# Altium schematic sheet MCU.SchDoc: MCU w/ USB & SDRAM Interface
size A2; DocumentNumber: 6; SheetNumber: 6; SheetTotal: 12
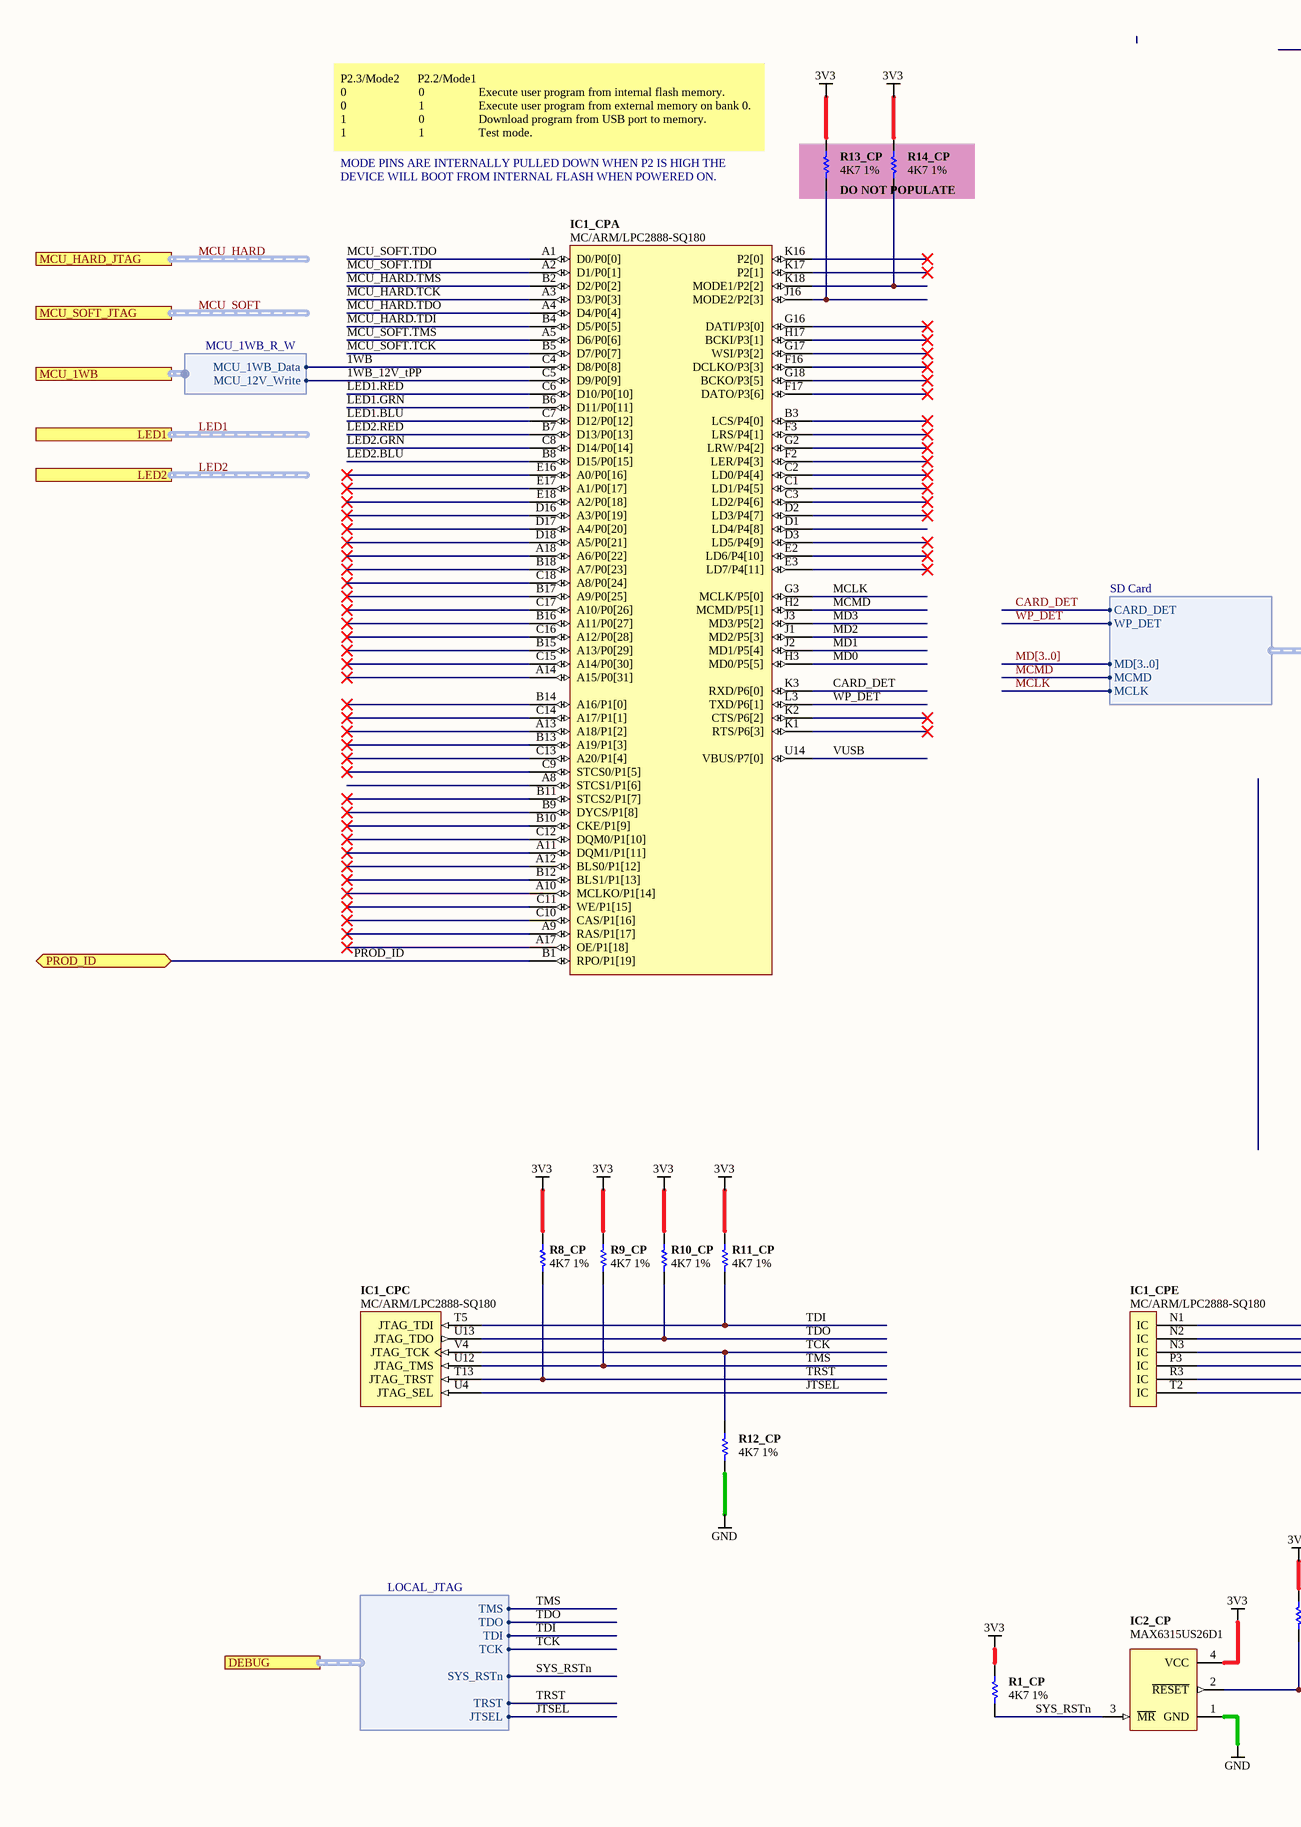
[diagram p0: MCU.SchDoc, left]
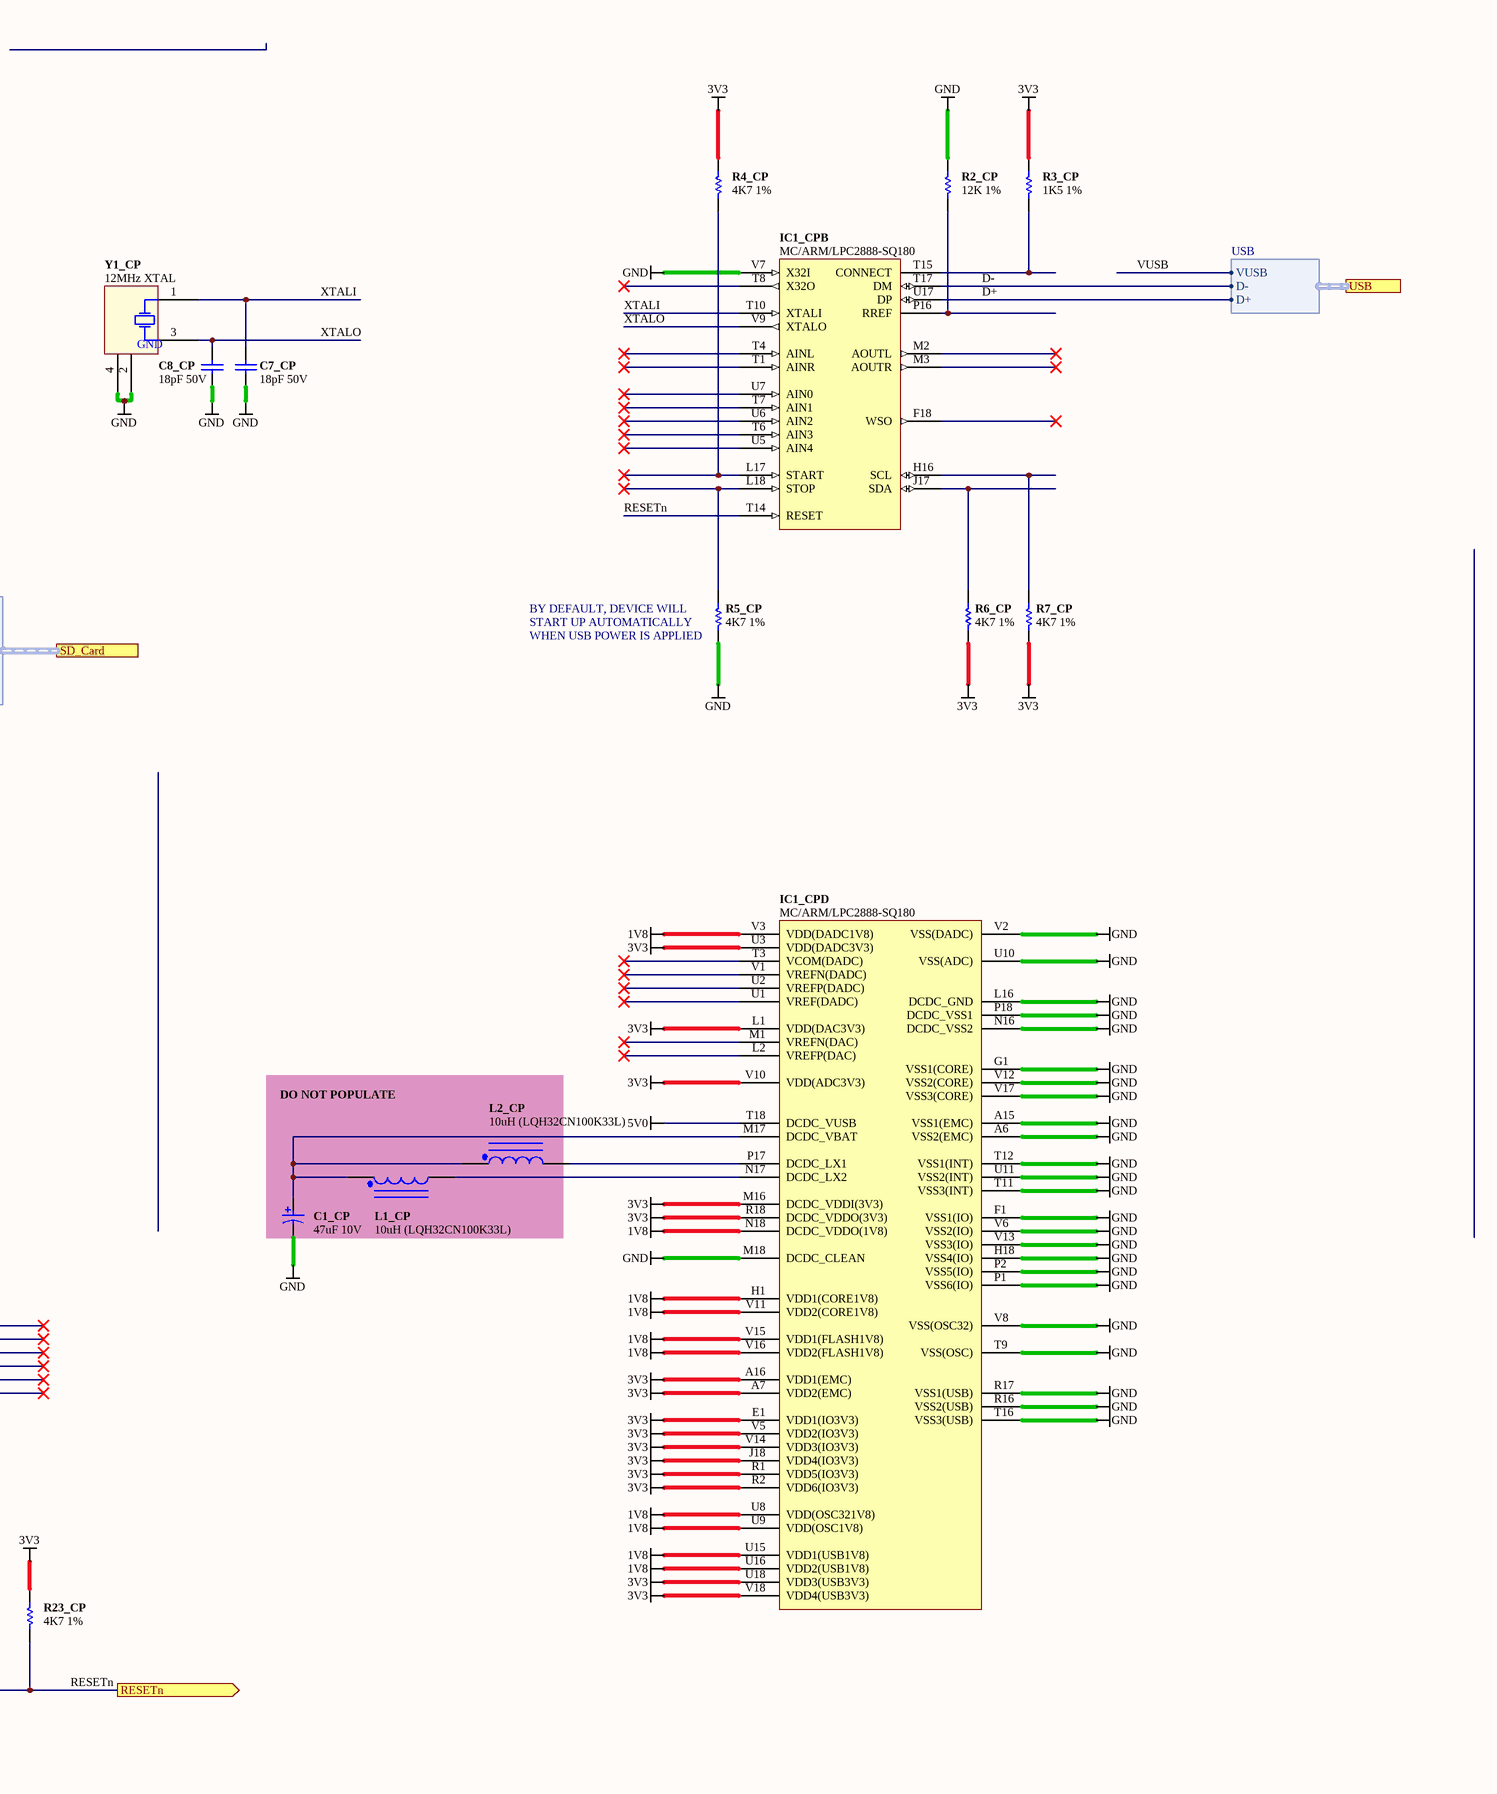
[diagram p1: MCU.SchDoc, right]

## Parts
C1_CP  47uF 10V  [CAPC3528-STAR]  (no BOM)
C7_CP  18pF 50V  [CAPC1005-STAR]
C8_CP  18pF 50V  [CAPC1005-STAR]
IC1_CP  MC/ARM/LPC2888-SQ180  [BGA50P18X18-180]  (parts A,B,C,D,E of 5)
IC2_CP  MAX6315US26D1  [SOT143]
L1_CP  10uH (LQH32CN100K33L)  [3261]  (no BOM)
L2_CP  10uH (LQH32CN100K33L)  [3261]  (no BOM)
R1_CP  4K7 1%  [RESC1005-STAR]
R2_CP  12K 1%  [RESC1005-STAR]
R3_CP  1K5 1%  [RESC1005-STAR]
R4_CP  4K7 1%  [RESC1005-STAR]
R5_CP  4K7 1%  [RESC1005-STAR]
R6_CP  4K7 1%  [RESC1005-STAR]
R7_CP  4K7 1%  [RESC1005-STAR]
R8_CP  4K7 1%  [RESC1005-STAR]
R9_CP  4K7 1%  [RESC1005-STAR]
R10_CP  4K7 1%  [RESC1005-STAR]
R11_CP  4K7 1%  [RESC1005-STAR]
R12_CP  4K7 1%  [RESC1005-STAR]
R13_CP  4K7 1%  [RESC1005-STAR]  (no BOM)
R14_CP  4K7 1%  [RESC1005-STAR]  (no BOM)
R23_CP  4K7 1%  [RESC1005-STAR]
Y1_CP  12MHz XTAL  [XTAL-200X126-4]

## Blocks framed on the sheet
DO NOT POPULATE: R13_CP R14_CP
DO NOT POPULATE: C1_CP L1_CP L2_CP

## Ports
DEBUG (harness LOCAL_JTAG), LED1 (harness RGB_LED), LED2 (harness RGB_LED), MCU_1WB (harness MCU_1WB_R_W), MCU_HARD_JTAG (harness JTAG), MCU_SOFT_JTAG (harness JTAG), PROD_ID (bidir), RESETn (out), SD_Card (harness SD Card), USB (harness USB)

## Harnesses
USB: VUSB, D-, D+
LOCAL_JTAG: TMS, TDO, TDI, TCK, SYS_RSTn, TRST, JTSEL
MCU_1WB_R_W: MCU_1WB_Data, MCU_12V_Write
SD Card: CARD_DET, WP_DET, MD[3..0], MCLK, MCMD

## Nets
1V8: IC1_CP.H1(VDD1(CORE1V8)) IC1_CP.N18(DCDC_VDDO(1V8)) IC1_CP.U8(VDD(OSC321V8)) IC1_CP.U9(VDD(OSC1V8)) IC1_CP.U15(VDD1(USB1V8)) IC1_CP.U16(VDD2(USB1V8)) IC1_CP.V3(VDD(DADC1V8)) IC1_CP.V11(VDD2(CORE1V8)) IC1_CP.V15(VDD1(FLASH1V8)) IC1_CP.V16(VDD2(FLASH1V8))
3V3: IC1_CP.A7(VDD2(EMC)) IC1_CP.A16(VDD1(EMC)) IC1_CP.E1(VDD1(IO3V3)) IC1_CP.J18(VDD4(IO3V3)) IC1_CP.L1(VDD(DAC3V3)) IC1_CP.M16(DCDC_VDDI(3V3)) IC1_CP.R1(VDD5(IO3V3)) IC1_CP.R2(VDD6(IO3V3)) IC1_CP.R18(DCDC_VDDO(3V3)) IC1_CP.U3(VDD(DADC3V3)) IC1_CP.U18(VDD3(USB3V3)) IC1_CP.V5(VDD2(IO3V3)) IC1_CP.V10(VDD(ADC3V3)) IC1_CP.V14(VDD3(IO3V3)) IC1_CP.V18(VDD4(USB3V3)) IC2_CP.4(VCC) R1_CP.2 R3_CP.2 R4_CP.2 R6_CP.2 R7_CP.2 R8_CP.2 R9_CP.2 R10_CP.2 R11_CP.2 R13_CP.2 R14_CP.2 R23_CP.2
5V0: IC1_CP.T18(DCDC_VUSB)
GND: C1_CP.2 C7_CP.2 C8_CP.2 IC1_CP.A6(VSS2(EMC)) IC1_CP.A15(VSS1(EMC)) IC1_CP.F1(VSS1(IO)) IC1_CP.G1(VSS1(CORE)) IC1_CP.H18(VSS4(IO)) IC1_CP.L16(DCDC_GND) IC1_CP.M18(DCDC_CLEAN) IC1_CP.N16(DCDC_VSS2) IC1_CP.P1(VSS6(IO)) IC1_CP.P2(VSS5(IO)) IC1_CP.P18(DCDC_VSS1) IC1_CP.R16(VSS2(USB)) IC1_CP.R17(VSS1(USB)) IC1_CP.T9(VSS(OSC)) IC1_CP.T11(VSS3(INT)) IC1_CP.T12(VSS1(INT)) IC1_CP.T16(VSS3(USB)) IC1_CP.U10(VSS(ADC)) IC1_CP.U11(VSS2(INT)) IC1_CP.V2(VSS(DADC)) IC1_CP.V6(VSS2(IO)) IC1_CP.V7(X32I) IC1_CP.V8(VSS(OSC32)) IC1_CP.V12(VSS2(CORE)) IC1_CP.V13(VSS3(IO)) IC1_CP.V17(VSS3(CORE)) IC2_CP.1(GND) R2_CP.2 R5_CP.2 R12_CP.2 Y1_CP.2(GND) Y1_CP.4(GND)
1WB: IC1_CP.C4(D8/P0[8]) ; port MCU_1WB.MCU_1WB_Data
1WB_12V_tPP: IC1_CP.C5(D9/P0[9]) ; port MCU_1WB.MCU_12V_Write
CARD_DET: IC1_CP.K3(RXD/P6[0]) ; port SD_Card.CARD_DET
D+: IC1_CP.U17(DP) ; port USB.D+
D-: IC1_CP.T17(DM) ; port USB.D-
JTSEL: IC1_CP.U4(JTAG_SEL) ; port DEBUG.JTSEL
LED1.BLU: IC1_CP.C7(D12/P0[12])
LED1.GRN: IC1_CP.B6(D11/P0[11])
LED1.RED: IC1_CP.C6(D10/P0[10])
LED2.BLU: IC1_CP.B8(D15/P0[15])
LED2.GRN: IC1_CP.C8(D14/P0[14])
LED2.RED: IC1_CP.B7(D13/P0[13])
MCLK: IC1_CP.G3(MCLK/P5[0]) ; port SD_Card.MCLK
MCMD: IC1_CP.H2(MCMD/P5[1]) ; port SD_Card.MCMD
MCU_HARD.TCK: IC1_CP.A3(D3/P0[3])
MCU_HARD.TDI: IC1_CP.B4(D5/P0[5])
MCU_HARD.TDO: IC1_CP.A4(D4/P0[4])
MCU_HARD.TMS: IC1_CP.B2(D2/P0[2])
MCU_SOFT.TCK: IC1_CP.B5(D7/P0[7])
MCU_SOFT.TDI: IC1_CP.A2(D1/P0[1])
MCU_SOFT.TDO: IC1_CP.A1(D0/P0[0])
MCU_SOFT.TMS: IC1_CP.A5(D6/P0[6])
MD0: IC1_CP.H3(MD0/P5[5])
MD1: IC1_CP.J2(MD1/P5[4])
MD2: IC1_CP.J1(MD2/P5[3])
MD3: IC1_CP.J3(MD3/P5[2])
PROD_ID: IC1_CP.B1(RPO/P1[19]) ; port PROD_ID
RESETn: IC1_CP.T14(RESET) IC2_CP.2(~{RESET}) R23_CP.1 ; port RESETn
SYS_RSTn: IC2_CP.3(~{MR}) R1_CP.1 ; port DEBUG.SYS_RSTn
TCK: IC1_CP.V4(JTAG_TCK) R12_CP.1 ; port DEBUG.TCK
TDI: IC1_CP.T5(JTAG_TDI) R11_CP.1 ; port DEBUG.TDI
TDO: IC1_CP.U13(JTAG_TDO) R10_CP.1 ; port DEBUG.TDO
TMS: IC1_CP.U12(JTAG_TMS) R9_CP.1 ; port DEBUG.TMS
TRST: IC1_CP.T13(JTAG_TRST) R8_CP.1 ; port DEBUG.TRST
VUSB: IC1_CP.U14(VBUS/P7[0]) ; port USB.VUSB
WP_DET: IC1_CP.L3(TXD/P6[1]) ; port SD_Card.WP_DET
XTALI: C7_CP.1 IC1_CP.T10(XTALI) Y1_CP.1(X1)
XTALO: C8_CP.1 IC1_CP.V9(XTALO) Y1_CP.3(X2)
NetC1_CP_1: C1_CP.1 IC1_CP.M17(DCDC_VBAT) L1_CP.1 L2_CP.1
NetIC1_CP_H16: IC1_CP.H16(SCL) R7_CP.1
NetIC1_CP_J16: IC1_CP.J16(MODE2/P2[3]) R13_CP.1
NetIC1_CP_J17: IC1_CP.J17(SDA) R6_CP.1
NetIC1_CP_K18: IC1_CP.K18(MODE1/P2[2]) R14_CP.1
NetIC1_CP_L17: IC1_CP.L17(START) R4_CP.1
NetIC1_CP_L18: IC1_CP.L18(STOP) R5_CP.1
NetIC1_CP_N17: IC1_CP.N17(DCDC_LX2) L1_CP.2
NetIC1_CP_P16: IC1_CP.P16(RREF) R2_CP.1
NetIC1_CP_P17: IC1_CP.P17(DCDC_LX1) L2_CP.2
NetIC1_CP_T15: IC1_CP.T15(CONNECT) R3_CP.1

Not connected (* = marked no-connect by the designer): IC1_CP A8(STCS1/P1[6]) A9(RAS/P1[17])* A10(MCLKO/P1[14])* A11(DQM1/P1[11])* A12(BLS0/P1[12])* A13(A18/P1[2])* A14(A15/P0[31])* A17(OE/P1[18])* A18(A6/P0[22])* B3(LCS/P4[0])* B9(DYCS/P1[8])* B10(CKE/P1[9])* B11(STCS2/P1[7])* B12(BLS1/P1[13])* B13(A19/P1[3])* B14(A16/P1[0])* B15(A13/P0[29])* B16(A11/P0[27])* B17(A9/P0[25])* B18(A7/P0[23])* C1(LD1/P4[5])* C2(LD0/P4[4])* C3(LD2/P4[6])* C9(STCS0/P1[5])* C10(CAS/P1[16])* C11(WE/P1[15])* C12(DQM0/P1[10])* C13(A20/P1[4])* C14(A17/P1[1])* C15(A14/P0[30])* C16(A12/P0[28])* C17(A10/P0[26])* C18(A8/P0[24])* D1(LD4/P4[8]) D2(LD3/P4[7])* D3(LD5/P4[9])* D16(A3/P0[19])* D17(A4/P0[20])* D18(A5/P0[21])* E2(LD6/P4[10])* E3(LD7/P4[11])* E16(A0/P0[16])* E17(A1/P0[17])* E18(A2/P0[18])* F2(LER/P4[3])* F3(LRS/P4[1])* F16(DCLKO/P3[3])* F17(DATO/P3[6])* F18(WSO)* G2(LRW/P4[2])* G16(DATI/P3[0])* G17(WSI/P3[2])* G18(BCKO/P3[5])* H17(BCKI/P3[1])* K1(RTS/P6[3])* K2(CTS/P6[2])* K16(P2[0])* K17(P2[1])* L2(VREFP(DAC))* M1(VREFN(DAC))* M2(AOUTL)* M3(AOUTR)* N1(IC)* N2(IC)* N3(IC)* P3(IC)* R3(IC)* T1(AINR)* T2(IC)* T3(VCOM(DADC))* T4(AINL)* T6(AIN3)* T7(AIN1)* T8(X32O)* U1(VREF(DADC))* U2(VREFP(DADC))* U5(AIN4)* U6(AIN2)* U7(AIN0)* V1(VREFN(DADC))*

## Buses and harness runs
bus MD[3..0]
harness LED1 = port LED1
harness LED2 = port LED2
harness MCU_HARD = port MCU_HARD_JTAG
harness MCU_SOFT = port MCU_SOFT_JTAG

## Notes on the sheet
- P2.3/Mode2      P2.2/Mode1
  0                        0                  Execute user program from internal flash memory.
  0                        1                  Execute user program from external memory on bank 0.
  1                        0                  Download program from USB port to memory.
  1                        1                  Test mode.
- MODE PINS ARE INTERNALLY PULLED DOWN WHEN P2 IS HIGH THE
- DEVICE WILL BOOT FROM INTERNAL FLASH WHEN POWERED ON.
- (near R5_CP) BY DEFAULT, DEVICE WILL
- START UP AUTOMATICALLY
- (near R5_CP) WHEN USB POWER IS APPLIED
- Project Title
- Sheet Title
- Size:
- Date:
- File:
- A2
- Assy:
- Time:
- Revision:
- Sheet
- of

## Library data of the parts
C1_CP = D-101-0001: Capacitor, Tantalum, 47uF 20% 10V MCCT-B (3528-12); Polarity: Polarized; Category: Capacitor; Capacitance: 47 uF; Mounting Technology: Surface Mount; Rated Voltage: 10 V; Status: Deprecated; Technology: Tantalum; Tolerance: 20 %
C7_CP C8_CP = D-101-0089: Capacitor, Ceramic, 18pF 5% 50V 0402 (1005) COG; Polarity: Non-Polarized; Rated Voltage: 50 mV; Category: Capacitor; Capacitance: 18 pF; Dielectric: COG; Mounting Technology: Surface Mount; Status: Unreleased; Technology: Ceramic; Tolerance: 5 %
IC1_CP = D-242-0001: 16/32-bit ARM microcontrollers; 8 kB cache, up to 1 MB flash,  High Speed USB 2.0 device, and SDRAM memory interface; Bit Width: Bits; Max Clock Frequency: Hz; Supply Voltage: mV; Mounting Technology: Surface Mount; Status: Unreleased; Category: IC-MCU
IC2_CP = D-243-0000: MAX6315, Open-Drain Output SOT Reset IC, Customized Reset Thresholds, Timeout Delays; Category: IC-Other; Status: Production
L1_CP L2_CP = D-102-0011: Inductor, 10uH, 450mA, 0.3R, 1210 (3225) LQH32CN100K33L; Category: Inductor; Inductance: 10 uH; Max Input Current: 450 mA; Mounting Technology: Surface Mount; Status: Production
R1_CP R4_CP R5_CP R6_CP R7_CP R8_CP R9_CP R10_CP R11_CP R12_CP R13_CP R14_CP R23_CP = D-100-0088: Resistor, 4K7 1% 0402 (1005); Power Rating: 63 mW; Resistance: 4.7 K; Category: Resistor; Mounting Technology: Surface Mount; Status: Production; Tolerance: 1 %
R2_CP = D-100-0002: Resistor, 12K 1% 0402; Power Rating: mW; Resistance: mR; Tolerance: %; Category: Resistor; Mounting Technology: Surface Mount; Status: Unreleased
R3_CP = D-100-0003: Resistor, 1K5 1% 0402; Power Rating: mW; Resistance: mR; Tolerance: %; Category: Resistor; Mounting Technology: Surface Mount; Status: Unreleased
Y1_CP = D-103-0029: Crystal, SMD, 12.000000MHz Stab=50ppm 10.0pF; Frequency Stability: 50 ppm; Load Capacitance: 10 pF; Nominal Operational Voltage: mV; Category: Crystal; Frequency Tolerance: 50 ppm; Mounting Technology: Surface Mount; Nominal Fequency: 12 MHz; Status: Production